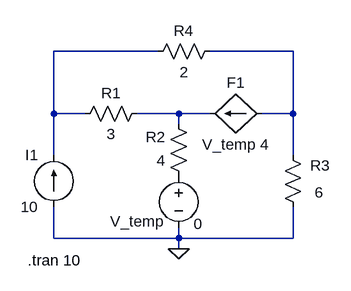
[diagram p0: schematic Q4.asc]
Q4.asc, the LTspice schematic file:
Version 4
SHEET 1 880 680
WIRE 192 48 32 48
WIRE 400 48 272 48
WIRE 32 144 32 48
WIRE 80 144 32 144
WIRE 224 144 160 144
WIRE 272 144 224 144
WIRE 400 144 400 48
WIRE 400 144 352 144
WIRE 224 160 224 144
WIRE 32 208 32 144
WIRE 400 208 400 144
WIRE 32 336 32 288
WIRE 224 336 224 320
WIRE 224 336 32 336
WIRE 400 336 400 288
WIRE 400 336 224 336
WIRE 224 352 224 336
FLAG 224 352 0
SYMBOL res 176 128 R90
WINDOW 0 0 56 VBottom 2
WINDOW 3 32 56 VTop 2
SYMATTR InstName R1
SYMATTR Value 3
SYMBOL res 240 256 R180
WINDOW 0 36 76 Left 2
WINDOW 3 36 40 Left 2
SYMATTR InstName R2
SYMATTR Value 4
SYMBOL res 416 304 R180
WINDOW 0 -41 80 Left 2
WINDOW 3 -31 39 Left 2
SYMATTR InstName R3
SYMATTR Value 6
SYMBOL res 288 32 R90
WINDOW 0 0 56 VBottom 2
WINDOW 3 32 56 VTop 2
SYMATTR InstName R4
SYMATTR Value 2
SYMBOL f 352 144 R90
WINDOW 0 -32 40 VBottom 2
WINDOW 3 32 40 VTop 2
SYMATTR InstName F1
SYMATTR Value V_temp 4
SYMBOL current 32 288 R180
WINDOW 0 24 80 Left 2
WINDOW 3 24 0 Left 2
WINDOW 123 0 0 Left 0
WINDOW 39 0 0 Left 0
SYMATTR InstName I1
SYMATTR Value 10
SYMBOL voltage 224 224 R0
WINDOW 0 -22 86 Right 2
WINDOW 3 23 90 Left 2
WINDOW 123 0 0 Left 0
WINDOW 39 0 0 Left 0
SYMATTR InstName V_temp
SYMATTR Value 0
TEXT -8 370 Left 2 !.tran 10

The netlist it stands for:
* Q4.asc
R1 N003 N001 3
R2 P001 N003 4
R3 0 N002 6
R4 N002 N001 2
F1 N002 N003 V_temp 4
I1 0 N001 10
V_temp P001 0 0
.tran 10
.backanno
.end